# Altium schematic sheet ldo.SchDoc
size A3; DocumentNumber: 8; SheetNumber: 8; SheetTotal: 11; SheetDescription: LDO supply for VDDIO
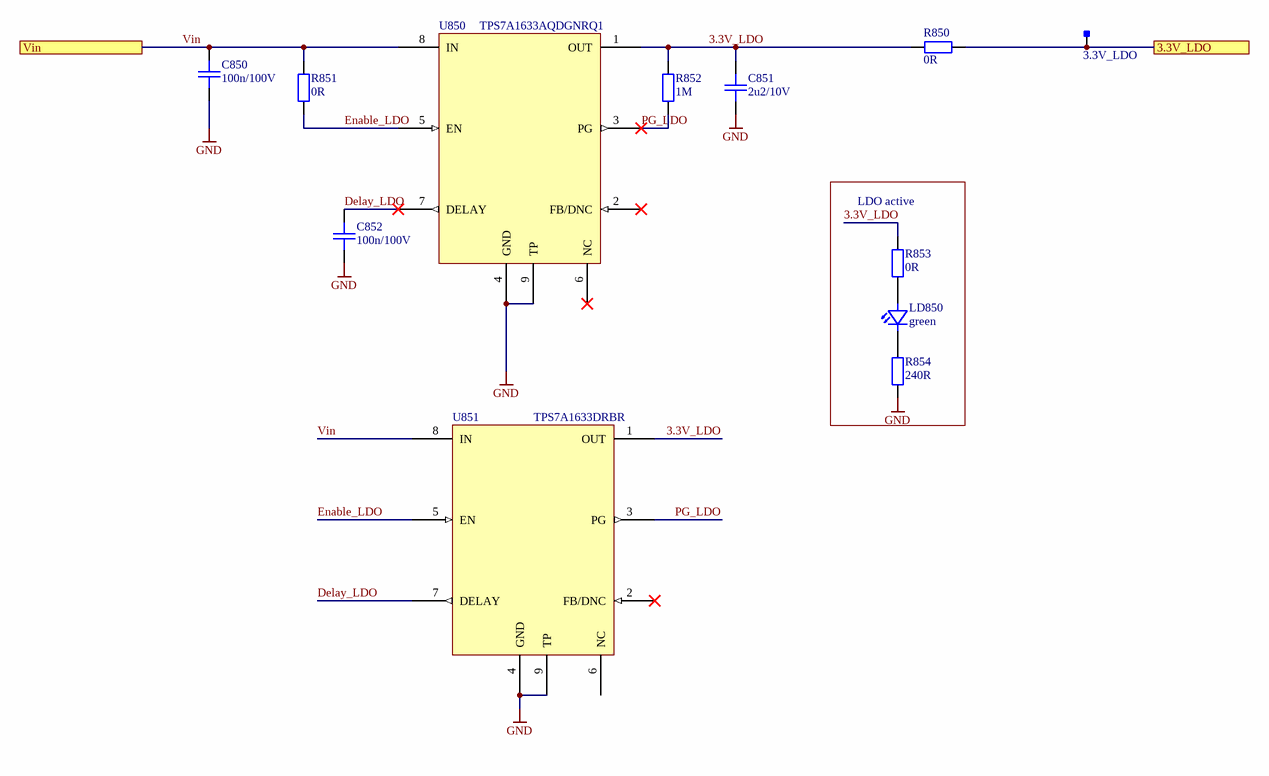
[diagram p0: ldo.SchDoc]

## Parts
3.3V_LDO  Testpoint_Square  [Testpoint_S1]  (value not drawn)  (no BOM)
C850  100n/100V  [CAPC1608X08N]
C851  2u2/10V  [CAPC2012X14N]
C852  100n/100V  [CAPC1608X08N]
LD850  green  [LEDC1608X07N]
R850  0R  [RESC1608X05N]
R851  0R  [RESC1608X05N]
R852  1M  [RESC1608X05N]
R853  0R  [RESC1608X05N]
R854  240R  [RESC1608X05N]
U850  TPS7A1633AQDGNRQ1  [TPS7A16A-Q1]
U851  TPS7A1633DRBR  [TPS7A16_VSON]

## Blocks framed on the sheet
LDO active: LD850 R853 R854

## Ports
3.3V_LDO, Vin

## Nets
GND: C850.1 C851.1 C852.1 R854.1 U850.4(GND) U850.9(TP) U851.4(GND) U851.9(TP)
3.3V_LDO: C851.2 R850.1 R852.2 R853.2 U850.1(OUT) U851.1(OUT)
3.3V_LDO: 3.3V_LDO.1 R850.2 ; port 3.3V_LDO  [a separate net that carries the same name]
Delay_LDO: C852.2 U850.7(DELAY) U851.7(DELAY)
Enable_LDO: R851.1 U850.5(EN) U851.5(EN)
PG_LDO: R852.1 U850.3(PG) U851.3(PG)
Vin: C850.2 R851.2 U850.8(IN) U851.8(IN) ; port Vin
NetLD850_1: LD850.1(C) R854.2
NetLD850_2: LD850.2(A) R853.1

Not connected (* = marked no-connect by the designer): U850 2(FB/DNC)* 6(NC)*; U851 2(FB/DNC)* 6(NC)

## Notes on the sheet
- Fraunhofer IISB
- Schottkystr. 10
- developed by:
- 91058 Erlangen
- Germany
- Author
- Project
- License
- Description
- File
- Version
- Release Date
- Sheet
- foxbms.org <https://foxbms.org>
- www.iisb.fraunhofer.de <https://www.iisb.fraunhofer.de/>
- foxBMS Team
- /

## Library data of the parts
3.3V_LDO = Testpoint_Square: Testpoint, square; Automotive Qualified: False; Part Number: Testpoint_Square
C850 C852 = gen_C_ceramic_100n_100V_X7R_0603: MLCC; Capacitance: 100n; Rated Voltage: 100V; Dielectric: X7R; Case EIA: 0603; Case Metric: 1608; Automotive Qualified: True; PnP Package: 0603C; Part Number: gen_C_ceramic_100n_100V_X7R_0603; Supplier 1: Digikey; Supplier Part Number 1: 490-13420-1-ND; Supplier 2: Mouser; Supplier Part Number 2: 81-GCJ188R72A104KA1D
C851 = gen_C_ceramic_2u2_10V_X7R_0805: MLCC; Capacitance: 2u2; Rated Voltage: 10V; Dielectric: X7R; Case EIA: 0805; Case Metric: 2012; Automotive Qualified: True; Part Number: gen_C_ceramic_2u2_10V_X7R_0805; Supplier 1: Farnell; Supplier Part Number 1: 2478259; Supplier 2: Farnell; Supplier Part Number 2: 2070513
LD850 = LED_0603_green_AECQ: TLMG1100-GS08; Manufacturer: Vishay; Breakdown Voltage: 5V; Continuous Forward Current: 20mA; Forward Voltage @ 20mA: 2.1V; Automotive Qualified: True; Part Number: LED_0603_green_AECQ; Color: green; Supplier 1: Farnell; Supplier Part Number 1: 2293494; PnP Package: LED_0603; Operating Temperature: -40°C - 100°C; ComponentLink1Description: Datasheet; ComponentLink1URL: http://www.farnell.com/datasheets/2049164.pdf; Supplier 2: Digikey; Supplier Part Number 2: 751-1165-1-ND
R850 = gen_R_0R_0603: SMD Resistor 0R 0603; Power: 0.1W; Case EIA: 0603; Case Metric: 1608; Maximum Working Voltage: 75V; PnP Package: 0603R; PnP equipped: x; Automotive Qualified: True; Part Number: gen_R_0R_0603; Operating Temperature: -55°C - +155°C; Resistance: 0R; Series: Jumper; PnP Value: 0R; Supplier 1: Farnell; Supplier Part Number 1: 2616580
R851 R853 = gen_R_0R_0603: SMD Resistor 0R 0603; Power: 0.1W; Case EIA: 0603; Case Metric: 1608; Maximum Working Voltage: 75V; PnP Package: 0603R; Automotive Qualified: True; PnP equipped: x; Part Number: gen_R_0R_0603; Operating Temperature: -55°C - +155°C; Resistance: 0R; Series: Jumper; PnP Value: 0R; Supplier 1: Farnell; Supplier Part Number 1: 2616580
R852 = gen_R_1M_0603: SMD Resistor 1M 0603; Tolerance: 1%; Power: 0.1W; Case EIA: 0603; Case Metric: 1608; Maximum Working Voltage: 75V; PnP Package: 0603R; Automotive Qualified: True; Part Number: gen_R_1M_0603; Operating Temperature: -55°C - +155°C; Resistance: 1M; Series: E24, E96; PnP Value: 1M; Supplier 1: Farnell; Supplier Part Number 1: 1469746
R854 = gen_R_240R_0603: SMD Resistor 240R 0603; Tolerance: 1%; Power: 0.1W; Case EIA: 0603; Case Metric: 1608; Maximum Working Voltage: 75V; PnP Package: 0603R; Automotive Qualified: True; AEC-Q Norm: AEC-Q200; Part Number: gen_R_240R_0603; Operating Temperature: -55°C - +155°C; Resistance: 240R; Series: E24; PnP Value: 240R; Supplier 1: Mouser; Supplier Part Number 1: 667-ERJ-3EKF2400V; ECCN: EAR99
U850 = TPS7A1633AQDGNRQ1: Automotive 60-V, 5-µA IQ, 100-mA low-dropout (LDO) voltage regulator with enable and power good; Manufacturer: Texas Instruments; PnP Package: HVSSOP-8; Automotive Qualified: True; AEC-Q Norm: AEC-Q100; AEC-Q Grade: Grade 1; Part Number: TPS7A1633AQDGNRQ1; Part Name: TPS7A16A-Q1; Operating Temperature: -40°C - +125°C; ComponentLink1Description: Datasheet; ComponentLink1URL: http://www.ti.com/lit/ds/symlink/tps7a16a-q1.pdf; Supplier 1: Digikey; Supplier Part Number 1: 296-TPS7A1633AQDGNRQ1TR-ND; Supplier 2: Mouser; Supplier Part Number 2: 595-PS7A1633AQDGNRQ1; ECCN: EAR99
U851 = TPS7A1633DRBR: Automotive 60-V, 5-µA IQ, 100-mA low-dropout (LDO) voltage regulator with enable and power good; Part Name: TPS7A16A-Q1; Manufacturer: Texas Instruments; PnP Package: VSON-8; Automotive Qualified: False; Part Number: TPS7A1633DRBR; Operating Temperature: -40°C - +125°C; ComponentLink1Description: Datasheet; ComponentLink1URL: https://www.ti.com/lit/ds/symlink/tps7a16.pdf; Supplier 1: Mouser; Supplier Part Number 1: 595-TPS7A1633DRBR / 595-TPS7A1633DRBR / 595-TPS7A1633DRBR; ECCN: EAR99